# Altium schematic sheet NIC_DP83848.SchDoc
size A4
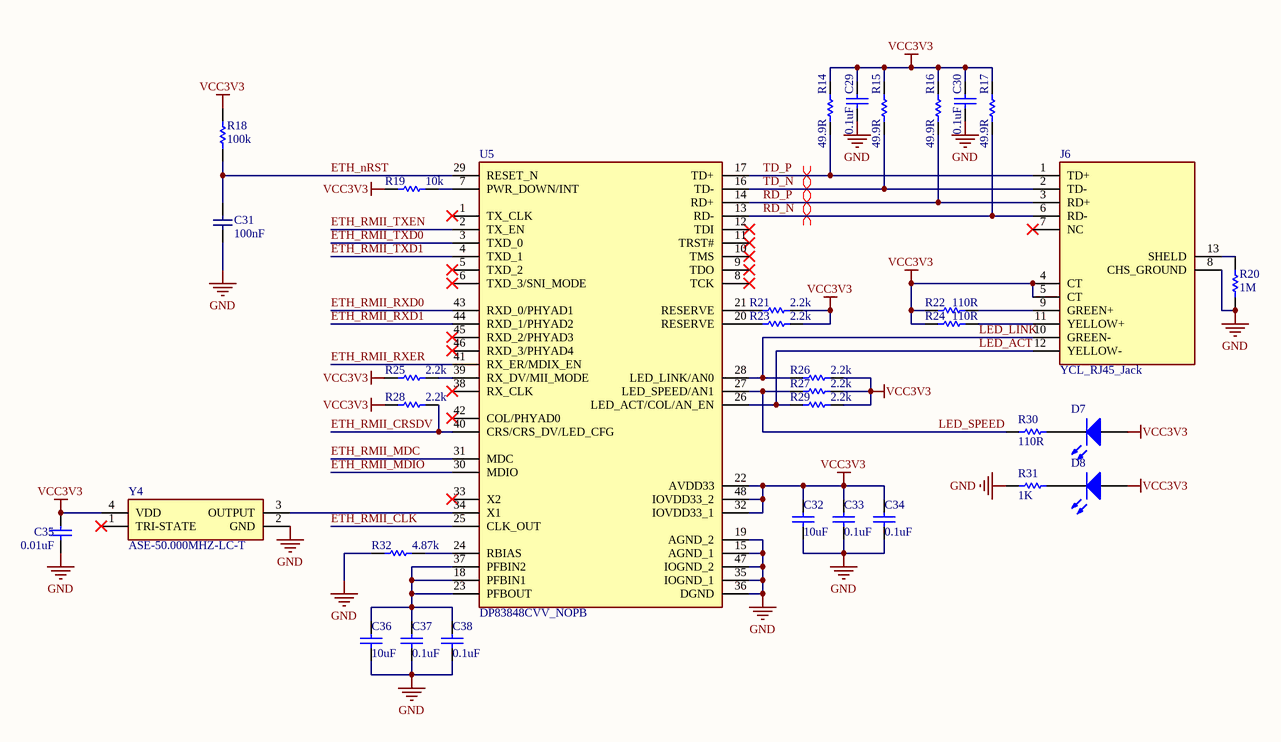
[diagram p0: NIC_DP83848.SchDoc]

## Parts
C29  0.1uF  [SMD0603]
C30  0.1uF  [SMD0603]
C31  100nF  [SMD0603]
C32  10uF  [SMD0603]
C33  0.1uF  [SMD0603]
C34  0.1uF  [SMD0603]
C35  value 0.01uF  [SMD0603]  (hidden comment: 0.1uF)
C36  10uF  [SMD0603]
C37  0.1uF  [SMD0603]
C38  0.1uF  [SMD0603]
D7  LED0  [SMD0603_LED]  (value not drawn)
D8  LED0  [SMD0603_LED]  (value not drawn)
J6  YCL_RJ45_Jack  [YCL_RJ45_Jack]
R14  49.9R  [SMD0603]
R15  49.9R  [SMD0603]
R16  49.9R  [SMD0603]
R17  49.9R  [SMD0603]
R18  100K  [SMD0603]
R19  10k  [SMD0603]
R20  1M  [SMD0603]
R21  2.2k  [SMD0603]
R22  110R  [SMD0603]
R23  2.2k  [SMD0603]
R24  110R  [SMD0603]
R25  2.2k  [SMD0603]
R26  2.2k  [SMD0603]
R27  2.2k  [SMD0603]
R28  2.2k  [SMD0603]
R29  2.2k  [SMD0603]
R30  value 110R  [SMD0603]  (hidden comment: 1K)
R31  1K  [SMD0603]
R32  4.87k  [SMD0603]
U5  DP83848CVV_NOPB  [QFP50P900X900X160-48N]
Y4  ASE-50.000MHZ-LC-T  [OSC3225]

## Nets
GND: C29.2 C30.2 C31.1 C32.2 C33.2 C34.2 C35.2 C36.2 C37.2 C38.2 J6.8(CHS_GROUND) R20.1 R31.1 R32.2 U5.15(AGND_1) U5.19(AGND_2) U5.35(IOGND_1) U5.36(DGND) U5.47(IOGND_2) Y4.2(GND)
VCC3V3: C29.1 C30.1 C32.1 C33.1 C34.1 C35.1 D7.1(A) D8.1(A) J6.4(CT) J6.5(CT) R14.1 R15.1 R16.1 R17.1 R18.2 R19.2 R21.1 R22.1 R23.2 R24.1 R25.2 R26.1 R27.2 R28.2 R29.1 U5.22(AVDD33) U5.32(IOVDD33_1) U5.48(IOVDD33_2) Y4.4(VDD)
ETH_nRST: C31.2 R18.1 U5.29(RESET_N)
ETH_RMII_CLK: U5.25(CLK_OUT)
ETH_RMII_CRSDV: R28.1 U5.40(CRS/CRS_DV/LED_CFG)
ETH_RMII_MDC: U5.31(MDC)
ETH_RMII_MDIO: U5.30(MDIO)
ETH_RMII_RXD0: U5.43(RXD_0/PHYAD1)
ETH_RMII_RXD1: U5.44(RXD_1/PHYAD2)
ETH_RMII_RXER: U5.41(RX_ER/MDIX_EN)
ETH_RMII_TXD0: U5.3(TXD_0)
ETH_RMII_TXD1: U5.4(TXD_1)
ETH_RMII_TXEN: U5.2(TX_EN)
LED_ACT: J6.12(YELLOW-) R29.2 U5.26(LED_ACT/COL/AN_EN)
LED_LINK: J6.10(GREEN-) R26.2 U5.28(LED_LINK/AN0)
LED_SPEED: R27.1 R30.1 U5.27(LED_SPEED/AN1)
RD_N: J6.6(RD-) R17.2 U5.13(RD-)
RD_P: J6.3(RD+) R16.2 U5.14(RD+)
TD_N: J6.2(TD-) R15.2 U5.16(TD-)
TD_P: J6.1(TD+) R14.2 U5.17(TD+)
NetC36_1: C36.1 C37.1 C38.1 U5.18(PFBIN1) U5.23(PFBOUT) U5.37(PFBIN2)
NetD7_2: D7.2(K) R30.2
NetD8_2: D8.2(K) R31.2
NetJ6_9: J6.9(GREEN+) R22.2
NetJ6_11: J6.11(YELLOW+) R24.2
NetJ6_13: J6.13(SHELD) R20.2
NetR19_1: R19.1 U5.7(PWR_DOWN/INT)
NetR21_2: R21.2 U5.21(RESERVE)
NetR23_1: R23.1 U5.20(RESERVE)
NetR25_1: R25.1 U5.39(RX_DV/MII_MODE)
NetR32_1: R32.1 U5.24(RBIAS)
NetU5_34: U5.34(X1) Y4.3(OUTPUT)

Not connected (* = marked no-connect by the designer): J6 7(NC)*; U5 1(TX_CLK)* 5(TXD_2)* 6(TXD_3/SNI_MODE)* 8(TCK)* 9(TDO)* 10(TMS)* 11(TRST#)* 12(TDI)* 33(X2)* 38(RX_CLK)* 42(COL/PHYAD0)* 45(RXD_2/PHYAD3)* 46(RXD_3/PHYAD4)*; Y4 1(TRI-STATE)*

## Layout directives
differential pair: RD_N, RD_P, TD_N, TD_P

## Notes on the sheet
- Title
- Size:
- Date:
- A4
- Number:
- Time:
- Revision:
- Sheet
- of
- File:

## Library data of the parts
C29 C30 C32-C38 = Cap Semi: Capacitor (Semiconductor SIM Model); Published: 8-Jun-2000; LatestRevisionDate: 29-May-2009; LatestRevisionNote: IPC-7351 Footprint Added.; PackageReference: C1206; Publisher: Altium Limited; PackageDescription: Chip Capacitor
  C29 C30 C33 C34 C37 C38: Value: 0.1uF
  C32 C36: Value: 10uF
C31 = Cap: Capacitor (Semiconductor SIM Model); Value: 100nF
D7 D8 = LED0: Typical INFRARED GaAs LED; Published: 8-Jun-2000; LatestRevisionDate: 08-Jul-2005; LatestRevisionNote: Mech Layer 1 removed.; PackageReference: LED-0; Publisher: Altium Limited; PackageDescription: LED; 2 Leads
J6 = YCL_RJ45_Jack: Connector; Manufacturer_Name: Pulse; Manufacturer_Part_Number: J0011D21BNL; Datasheet Link: https://www.mouser.de/datasheet/2/336/J403-370307.pdf; Height: 16.39mm
R14-R17 R19-R32 = Res Semi: Semiconductor Resistor; Published: 8-Jun-2000; LatestRevisionDate: 17-Jul-2002; LatestRevisionNote: Re-released for DXP Platform.; PackageReference: AXIAL-0.5; Publisher: Altium Limited; PackageDescription: Axial Device, Thru-Hole; 2 Leads; 0.5 in Pin Spacing
  R14-R17: Value: 49.9R
  R19: Value: 10k
  R20: Value: 1M
  R21 R23 R25-R29: Value: 2.2k
  R22 R24: Value: 110R
  R31: Value: 1K
  R32: Value: 4.87k
R18 = Res: Semiconductor Resistor; Value: 100k
U5 = DP83848CVV: Ethernet phy
Y4 = ASE-50.000MHZ-LC-T: Crystal or Oscillator; Manufacturer_Name: ABRACON; Datasheet Link: https://componentsearchengine.com//ASE-50.000MHZ-LC-T.pdf; Height: 1.2mm; Mouser2 Part Number: 815-ASE50.000MHZLCT; Mouser2 Price/Stock: https://www.mouser.com/Search/Refine.aspx?Keyword=815-ASE50.000MHZLCT; Manufacturer_Part_Number: ASE-50.000MHZ-LC-T